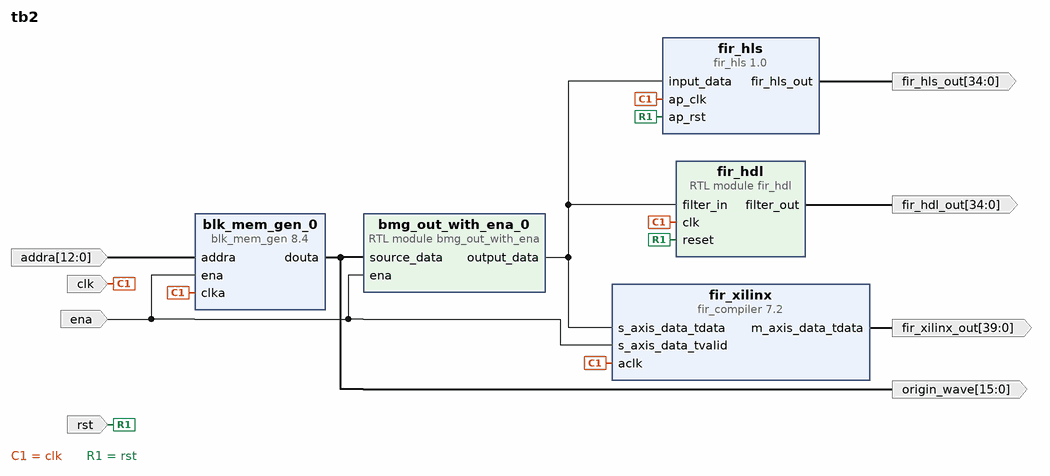
[diagram p0: block diagram of the top level]
# Vivado block design tb2, xczu28dr-ffvg1517-1-e, Vivado 2022.1
create_bd_design tb2

create_bd_port -dir I -type clk clk
set_property -dict {CONFIG.ASSOCIATED_RESET rst CONFIG.FREQ_HZ 80000000 CONFIG.PHASE 0.000} [get_bd_ports clk]
create_bd_port -dir O -from 15 -to 0 -type data origin_wave
create_bd_port -dir I -type rst rst
set_property -dict {CONFIG.POLARITY ACTIVE_HIGH} [get_bd_ports rst]
create_bd_port -dir I ena
create_bd_port -dir I -from 12 -to 0 addra
create_bd_port -dir O -from 39 -to 0 fir_xilinx_out
create_bd_port -dir O -from 34 -to 0 fir_hdl_out
create_bd_port -dir O -from 34 -to 0 fir_hls_out

create_bd_cell -type ip -vlnv xilinx.com:ip:blk_mem_gen:8.4 blk_mem_gen_0
set_property -dict [list \
  CONFIG.Coe_File ../../../../../../../../8192_data_with_interference.coe \
  CONFIG.Enable_32bit_Address false \
  CONFIG.Enable_A Use_ENA_Pin \
  CONFIG.Load_Init_File true \
  CONFIG.Memory_Type Single_Port_ROM \
  CONFIG.Port_A_Write_Rate 0 \
  CONFIG.Register_PortA_Output_of_Memory_Primitives false \
  CONFIG.Use_RSTA_Pin false \
  CONFIG.Write_Depth_A 8192 \
  CONFIG.Write_Width_A 16 \
  CONFIG.use_bram_block Stand_Alone \
] [get_bd_cells blk_mem_gen_0]
create_bd_cell -type ip -vlnv xilinx.com:ip:fir_compiler:7.2 fir_xilinx
set_property -dict [list \
  CONFIG.Clock_Frequency 80 \
  CONFIG.CoefficientSource Vector \
  CONFIG.CoefficientVector {-20 ,-50 ,-52 ,-22 ,24 ,62 ,67 ,30 ,-33 ,-88 ,-97 ,-45 ,49 ,131 ,145 ,66 ,-73 ,-193 ,-212 ,-96 ,105 ,278 ,303 ,137 ,-149 ,-390 ,-422 ,-189 ,205 ,534 ,576 ,257 ,-277 ,-718 ,-772 ,-344 ,369 ,957 ,1028 ,457 ,-491 ,-1273 ,-1369 ,-610 ,657 ,1709 ,1846 ,827 ,-897 ,-2357 ,-2573 ,-1168 ,1288 ,3448 ,3855 ,1803 ,-2062 ,-5790 ,-6890 ,-3508 ,4530 ,15364 ,25665 ,31928 ,31928 ,25665 ,15364 ,4530 ,-3508 ,-6890 ,-5790 ,-2062 ,1803 ,3855 ,3448 ,1288 ,-1168 ,-2573 ,-2357 ,-897 ,827 ,1846 ,1709 ,657 ,-610 ,-1369 ,-1273 ,-491 ,457 ,1028 ,957 ,369 ,-344 ,-772 ,-718 ,-277 ,257 ,576 ,534 ,205 ,-189 ,-422 ,-390 ,-149 ,137 ,303 ,278 ,105 ,-96 ,-212 ,-193 ,-73 ,66 ,145 ,131 ,49 ,-45 ,-97 ,-88 ,-33 ,30 ,67 ,62 ,24 ,-22 ,-52 ,-50 ,-20} \
  CONFIG.Coefficient_Fanout true \
  CONFIG.Coefficient_File ../../../../../../../../matlab/untitled.coe \
  CONFIG.Coefficient_Fractional_Bits 0 \
  CONFIG.Coefficient_Sets 1 \
  CONFIG.Coefficient_Sign Signed \
  CONFIG.Coefficient_Structure Inferred \
  CONFIG.Coefficient_Width 16 \
  CONFIG.ColumnConfig 64 \
  CONFIG.Control_Broadcast_Fanout true \
  CONFIG.Control_Column_Fanout true \
  CONFIG.Control_LUT_Pipeline true \
  CONFIG.Control_Path_Fanout true \
  CONFIG.Data_Path_Broadcast false \
  CONFIG.Data_Path_Fanout true \
  CONFIG.Data_Width 16 \
  CONFIG.Disable_Half_Band_Centre_Tap false \
  CONFIG.Filter_Architecture Systolic_Multiply_Accumulate \
  CONFIG.No_BRAM_Read_First_Mode true \
  CONFIG.No_SRL_Attributes false \
  CONFIG.Optimal_Column_Lengths true \
  CONFIG.Optimization_Goal Speed \
  CONFIG.Optimization_List Data_Path_Fanout,Pre-Adder_Pipeline,Coefficient_Fanout,Control_Path_Fanout,Control_Column_Fanout,Control_Broadcast_Fanout,Control_LUT_Pipeline,No_BRAM_Read_First_Mode,Optimal_Column_Lengths,Other \
  CONFIG.Optimization_Selection All \
  CONFIG.Other true \
  CONFIG.Output_Rounding_Mode Full_Precision \
  CONFIG.Output_Width 35 \
  CONFIG.Pre_Adder_Pipeline true \
  CONFIG.Quantization Integer_Coefficients \
  CONFIG.Sample_Frequency 80 \
] [get_bd_cells fir_xilinx]
create_bd_cell -type module -reference bmg_out_with_ena bmg_out_with_ena_0
create_bd_cell -type ip -vlnv xilinx.com:hls:fir_hls:1.0 fir_hls
create_bd_cell -type module -reference fir_hdl fir_hdl

# ---- connections ----

connect_bd_net [get_bd_ports addra] [get_bd_pins blk_mem_gen_0/addra]
connect_bd_net [get_bd_pins blk_mem_gen_0/douta] [get_bd_ports origin_wave] [get_bd_pins bmg_out_with_ena_0/source_data]
connect_bd_net [get_bd_pins bmg_out_with_ena_0/output_data] \
  [get_bd_pins fir_xilinx/s_axis_data_tdata] [get_bd_pins fir_hls/input_data] [get_bd_pins fir_hdl/filter_in]
connect_bd_net [get_bd_ports clk] \
  [get_bd_pins blk_mem_gen_0/clka] [get_bd_pins fir_xilinx/aclk] [get_bd_pins fir_hls/ap_clk] [get_bd_pins fir_hdl/clk]
connect_bd_net [get_bd_ports ena] [get_bd_pins blk_mem_gen_0/ena] [get_bd_pins bmg_out_with_ena_0/ena] [get_bd_pins fir_xilinx/s_axis_data_tvalid]
connect_bd_net -net fir32hls_0_output_data [get_bd_pins fir_hls/fir_hls_out] [get_bd_ports fir_hls_out]
connect_bd_net -net fir_compiler_0_m_axis_data_tdata [get_bd_pins fir_xilinx/m_axis_data_tdata] [get_bd_ports fir_xilinx_out]
connect_bd_net -net fir_hdl_0_filter_out [get_bd_pins fir_hdl/filter_out] [get_bd_ports fir_hdl_out]
connect_bd_net [get_bd_ports rst] [get_bd_pins fir_hls/ap_rst] [get_bd_pins fir_hdl/reset]

validate_bd_design
save_bd_design
